# Altium schematic sheet Elan Chip Interface.schdoc: BROMCOM COMPUTERS PLC
size B; DocumentNumber: PCMCIA MPT1340 TEST PCB; Revision: 2.0; SheetNumber: 1; SheetTotal: 1
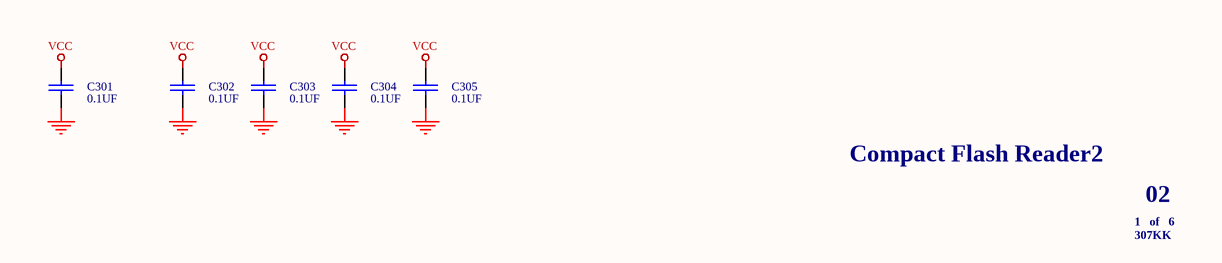
[diagram p0: Elan Chip Interface.schdoc]

## Parts
C301  0.1UF  [0603]
C302  0.1UF  [0603]
C303  0.1UF  [0603]
C304  0.1UF  [0603]
C305  0.1UF  [0603]

## Nets
GND_COM: C301.2 C302.2 C303.2 C304.2 C305.2
VCC: C301.1 C302.1 C303.1 C304.1 C305.1

## Notes on the sheet
- Compact Flash Reader2
- 1   of   6
- 02
- 307KK

## Library data of the parts
C301-C305 = CAP: Capacitor